# EAGLE design snes2p (EAGLE 7.7.0)
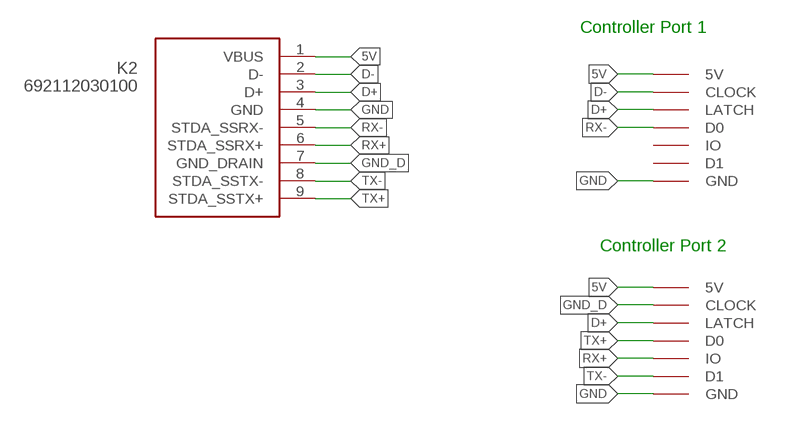
[diagram p0: schematic, sheet 1]

## Parts
K2  692112030100  [692112030100]
U$1  SNESCONN  [SNESCONN]
U$2  SNESCONN  [SNESCONN]

## Nets
5V: K2.1(VBUS) U$1.5V U$2.5V
D+: K2.3(D+) U$1.LATCH U$2.LATCH
D-: K2.2(D-) U$1.CLOCK
GND: K2.4(GND) U$1.GND U$2.GND
GND_D: K2.7(GND_DRAIN) U$2.CLOCK
RX+: K2.6(STDA_SSRX+) U$2.IO
RX-: K2.5(STDA_SSRX-) U$1.D0
TX+: K2.9(STDA_SSTX+) U$2.D0
TX-: K2.8(STDA_SSTX-) U$2.D1
Unconnected: U$1.D1 U$1.IO

## Notes on the sheet
- Controller Port 1
- Controller Port 2

## Library data of the parts
K2 = Wuerth_Elektronik_eiCan_Communication_Connectors_STENCIL:692112030100: WR-COM USB 3.0 SMT PLUG WITH CLIPTYPE A
U$1 U$2 = gamepad-conn:SNESCONN

## Board
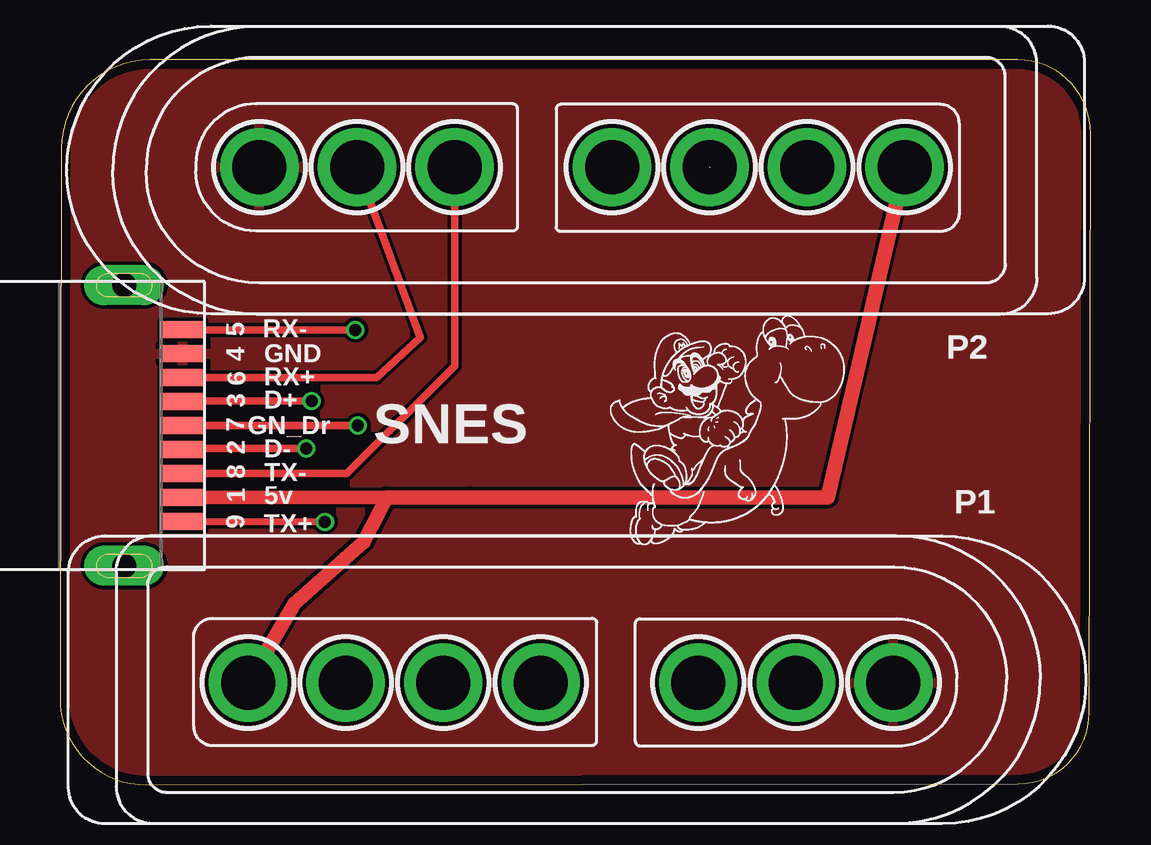
[diagram p1: board, top side]
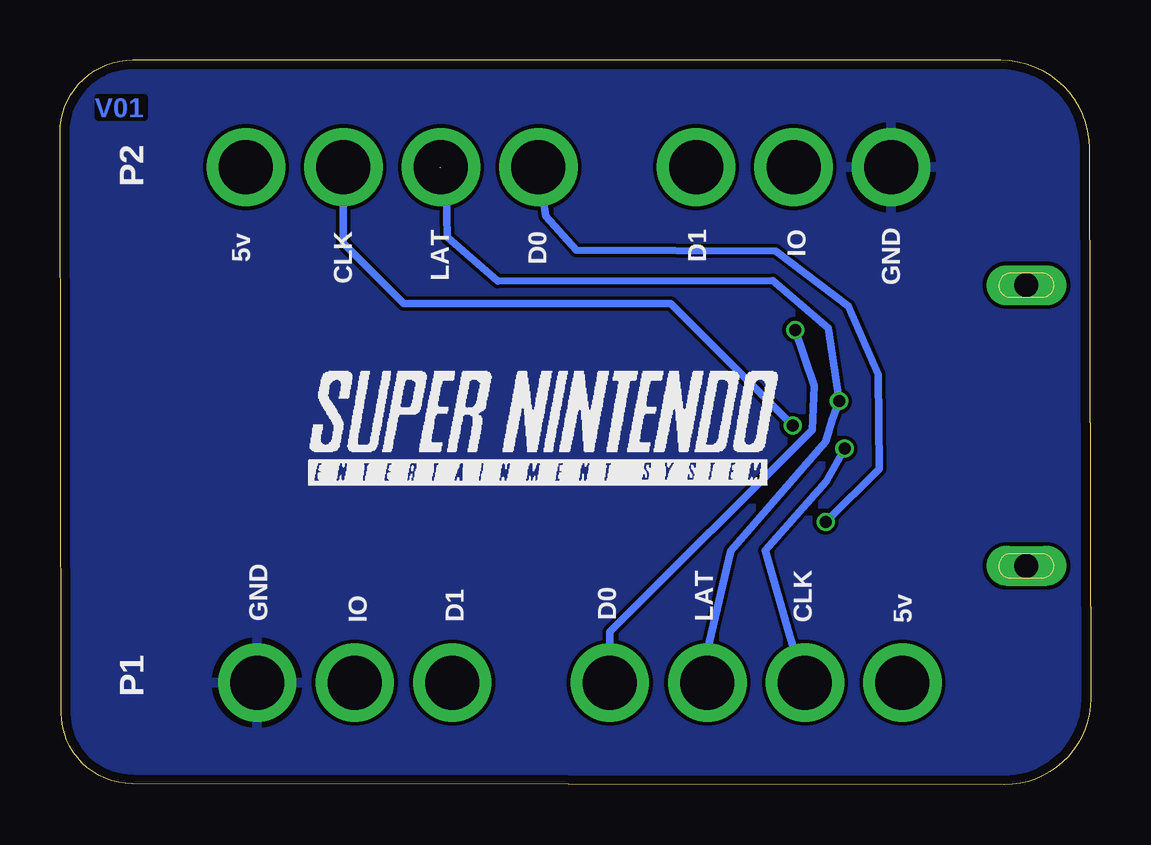
[diagram p2: board, bottom side, seen from below]

Size 42.94 x 30.22 mm. Coordinates in mm from the lower left corner, seen from the top.
Outline: 0.06,26.54 0,3.6 arc90 3.6,0 39.92,0.04 arc90 42.88,2.99 42.94,27.18 arc90 39.91,30.22 3.75,30.22 arc90 0.06,26.54
Copper layers (1*16): Top 0.035559375mm / dielectric 1.6mm / Bottom 0.035559375mm
Design rules "oshpark-2layer": minimum track width 6mil, minimum drill 10mil, track to track 6mil, track to pad 6mil, pad to pad 6mil, via to via 6mil, smd to smd 6mil, copper to edge 15mil, drill to drill 6mil, minimum pad ring 5mil, minimum via ring 5mil, stop-mask expansion 2.5mil, vias tented up to drill 0mil, thermal gap 10mil

### Footprints (pad centres in the part's own frame; a part is rotated, then mirrored left to right if it is on the bottom)
692112030100 = smd 0.7 x 1.8: 1 -3,0; 2 -1,0; 3 1,0; 4 3,0; 5 4,0; 6 2,0; 7 0,0; 8 -2,0; 9 -4,0 | drill 1 pad 1.676 long: Z1 5.85,2.45; Z2 -5.85,2.45
SNESCONN = drill 2.25 pad 3.25: 5V 0,4.064; CLOCK 4.064,4.064; D0 12.192,4.064; D1 18.756,4.064; GND 26.884,4.064; IO 22.82,4.064; LATCH 8.128,4.064

### Placement (x,y rotation side)
K2  5.12,14.98 90 top
U$1  7.84,0.2 0 top
U$2  35.2,29.82 180 top

### Tracks (layer width: path | path; a pad name or v marks a point on that pad's centre or on a via)
5V
  Top 0.559: K2.1 13.61,11.98
  Top 0.61: U$2.5V 32,11.98 17.06,11.98 13.61,11.98 12.67,10.13 9.77,7.54 U$1.5V
D+  (via drill 0.5)  (1 unrouted)
  Top 0.305: K2.3 5.14,16 v10.48,16
  Bottom 0.305: U$1.LATCH 15.87,4.77 15.89,5.94 15,9.75 11.04,14.32 10.76,15.24 v10.48,16 10.94,19.05 13.25,21.03 24.71,21 26.81,22.83 26.86,25.5 27.09,25.73
D-  (via drill 0.5)
  Top 0.305: K2.2 5.16,14.02 v10.25,14.02
  Bottom 0.305: v10.25,14.02 11.01,12.65 13.55,9.77 12.54,6.22 U$1.CLOCK
GND
  pour Bottom: 40.16,0.28 3.51,0 arc-90 0.09,3.39 0.07,26.53 arc-90 3.59,30.04 40.22,30 arc-89 42.68,27.95 43,4.28 arc-90
  pour Top: 40.2,0.44 3.73,0.04 arc-91 0.06,3.68 0.2,26.56 arc-90 3.88,30.21 40.05,30.13 arc-90 42.81,26.97 42.95,3.5 arc-90
GND_D  (via drill 0.5)
  Top 0.305: K2.7 v12.41,14.98
  Bottom 0.305: v12.41,14.98 17.49,20.06 28.62,20.06 31.13,22.58 U$2.CLOCK
RX+
  Top 0.305: K2.6 13.19,16.98 15.02,18.65 U$2.IO
RX-  (via drill 0.5)
  Top 0.305: K2.5 5.13,18.97 v12.31,18.97
  Bottom 0.305: v12.31,18.97 11.52,16.63 11.6,14.8 20.03,6.37 U$1.D0
TX+  (via drill 0.5)
  Top 0.305: K2.9 v11.04,10.97
  Bottom 0.305: v11.04,10.97 8.81,13.18 8.86,17.12 10.1,19.96 13.12,22.25 21.43,22.3 22.7,23.72 U$2.D0
TX-
  Top 0.305: K2.8 11.95,12.98 16.44,17.46 U$2.D1

### Text on the board
Bottom: V01
tPlace: 5 | RX- | P2 | 4 | GND | 6 | RX+ | 3 | D+ | 7 | GN_Dr | 2 | D- | SNES | 8 | TX- | 1 | 5v | 9 | TX+ | P1
bPlace: P2 | GND | IO | D1 | D0 | LAT | CLK | 5v | 5v | CLK | LAT | D0 | D1 | IO | GND | P1